# EAGLE design MySens-easyRS485-BluePill-V03-010 (EAGLE 9.1.0)
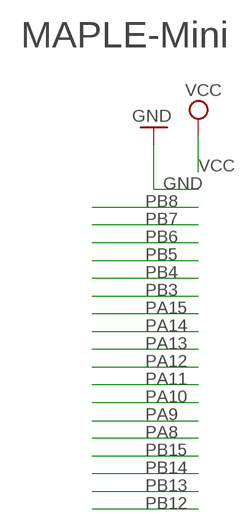
[diagram p0: schematic, sheet 1, part 1 of 2]
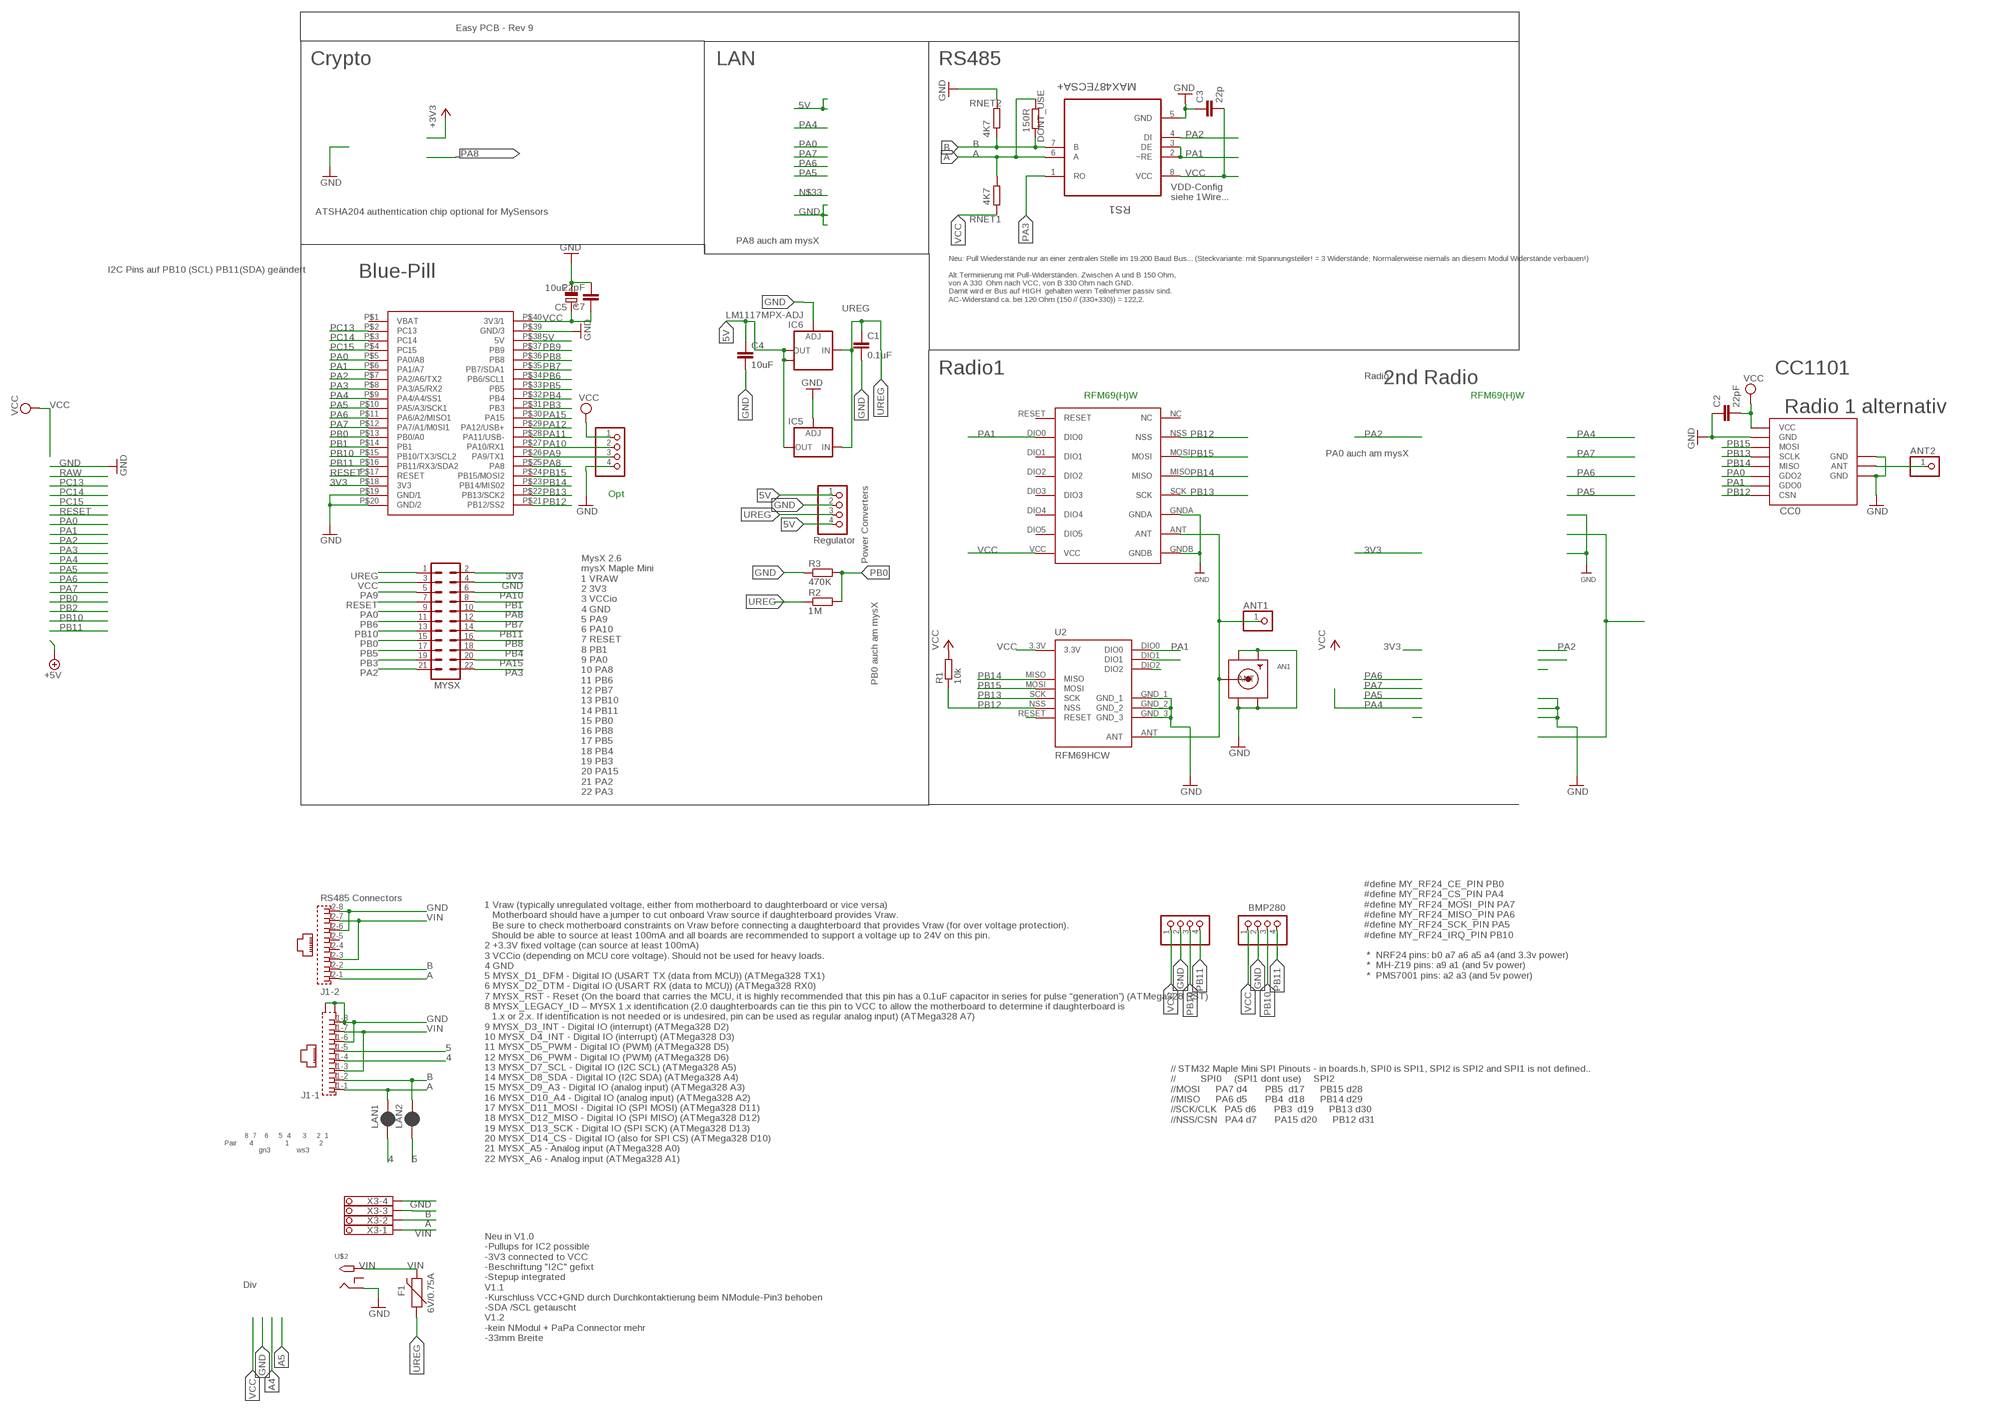
[diagram p1: schematic, sheet 1, part 2 of 2]

## Parts
AN1  SMACONNECTOR_EDGE  [SMA_EDGELAUNCH]
ANT1  PINHD-1X1  [1X01]
ANT2  PINHD-1X1  [1X01]
BH1750  PINHD-1X04_2.54-S  [1X04-S]
C1  0.1uF  C-EUC1206  [C1206]
C2  22pF  C-EUC0805  [C0805]
C3  22p  C-EUC0805  [C0805]
C4  10uF  C-EUC1210  [C1210]
C5  10uF  CPOL-EUR/2012-12W  [R/2012-12W]
C7  22pF  C-EUC0805  [C0805]
CC0  CC1101  CC1101_MODULE1SMD  [CC1101_MODULE1_SMD]
DBG  PINHD-1X04_2.54-S  [1X04-S]
DONT_USE  150R  R-EU_R0805  [R0805]
F1  6V/0.75A  PPTC_THREE-QUARTER-AMP  [1206]
I2C-1  PINHD-1X04_2.54-S  [1X04-S]
IC5  LD117ADT50TR  [DPACK]
IC6  LM1117MPX-ADJ  [SOT223]
J1  RJ45_2X_S  [RJ45_2X_S]
LAN1  JUMPER-SMT_2_NC_PASTE_SILK  [SMT-JUMPER_2_NC_PASTE_SILK]
LAN2  JUMPER-SMT_2_NC_PASTE_SILK  [SMT-JUMPER_2_NC_PASTE_SILK]
MYSX  MA11-2  [MA11-2]
R1  10k  R-EU_M0805  [M0805]
R2  1M  R-EU_R0805  [R0805]
R3  470K  R-EU_R0805  [R0805]
RFM69W1  RFM69HW  [RFM]
RNET1  4K7  R-EU_R0805  [R0805]
RNET2  4K7  R-EU_R0805  [R0805]
RS1  MAX487ECSA+  [SOIC127P600X175-8N]
STEPDWN  PINHD-1X04_2.54-S  [1X04-S]
U2  RFM69HCW  [RFM69HCW-XXXS2]
U$2  2.1MMJACKTHM  [PJ-102A]
U$4  BLUEPILL  [BLUEPILL]
X3  1751264  [1751264]

## Nets
3V3: MYSX.2 U$4.P$18(3V3) ; supply symbol labelled +3V3
4: J1.1-4 LAN1.1
5: J1.1-5 LAN2.1
5V: C4.1 IC5.4(OUT) IC6.2(OUT) IC6.TAB(OUT1) STEPDWN.1 STEPDWN.4 U$4.P$38(5V)
A: DONT_USE.1 J1.1-1 J1.2-1 LAN1.2 RNET1.2 RS1.6(A) X3.2
ANT0: ANT2.1 CC0.ANT
ANT1: AN1.P(ANT) ANT1.1 RFM69W1.ANT U2.ANT
B: DONT_USE.2 J1.1-2 J1.2-2 LAN2.2 RNET2.1 RS1.7(B) X3.3
GND [PWR]: AN1.GND@1(GND4) AN1.GND@2(GND3) AN1.GND@3(GND2) AN1.GND@4(GND1) BH1750.2 C1.2 C2.1 C3.1 C4.2 C5.- C7.2 CC0.GND@0(GND) CC0.GND@1(GND) CC0.GND@2(GND) DBG.4 I2C-1.2 IC5.1(ADJ) IC6.1(ADJ) J1.1-6 J1.1-8 J1.2-6 J1.2-8 J1.G1(-1:S2) J1.G3(-1:S1) MYSX.4 R3.1 RFM69W1.GNDA RFM69W1.GNDB RNET2.2 RS1.5(GND) STEPDWN.2 U2.GND_1 U2.GND_2 U2.GND_3 U$2.RING U$4.P$19(GND/1) U$4.P$20(GND/2) U$4.P$39(GND/3) X3.4
N$4: U2.DIO2
N$8: U2.DIO1
N$9: U2.RESET
PA0: CC0.GDO2 MYSX.9 U$4.P$5(PA0/A8)
PA1: CC0.GDO0 RFM69W1.DIO0 RS1.2(~RE) RS1.3(DE) U2.DIO0 U$4.P$6(PA1/A7)
PA2: MYSX.21 RS1.4(DI) U$4.P$7(PA2/A6/TX2)
PA3: MYSX.22 RS1.1(RO) U$4.P$8(PA3/A5/RX2)
PA4: U$4.P$9(PA4/A4/SS1)
PA5: U$4.P$10(PA5/A3/SCK1)
PA6: U$4.P$11(PA6/A2/MISO1)
PA7: U$4.P$12(PA7/A1/M0SI1)
PA8: MYSX.10 U$4.P$25(PA8)
PA9: DBG.3 MYSX.5 U$4.P$26(PA9/TX1)
PA10: DBG.2 MYSX.6 U$4.P$27(PA10/RX1)
PA11: U$4.P$28(PA11/USB-)
PA12: U$4.P$29(PA12/USB+)
PA15: MYSX.20 U$4.P$30(PA15)
PB0: MYSX.15 R2.2 R3.2 U$4.P$13(PB0/A0)
PB1: MYSX.8 U$4.P$14(PB1)
PB3: MYSX.19 U$4.P$31(PB3)
PB4: MYSX.18 U$4.P$32(PB4)
PB5: MYSX.17 U$4.P$33(PB5)
PB6: MYSX.11 U$4.P$34(PB6/SCL1)
PB7: MYSX.12 U$4.P$35(PB7/SDA1)
PB8: MYSX.16 U$4.P$36(PB8)
PB9: U$4.P$37(PB9)
PB10: BH1750.3 I2C-1.3 MYSX.13 U$4.P$15(PB10/TX3/SCL2)
PB11: BH1750.4 I2C-1.4 MYSX.14 U$4.P$16(PB11/RX3/SDA2)
PB12: CC0.CSN R1.1 RFM69W1.NSS U2.NSS U$4.P$21(PB12/SS2)
PB13: CC0.SCLK RFM69W1.SCK U2.SCK U$4.P$22(PB13/SCK2)
PB14: CC0.MISO RFM69W1.MISO U2.MISO U$4.P$23(PB14/MIS02)
PB15: CC0.MOSI RFM69W1.MOSI U2.MOSI U$4.P$24(PB15/MOSI2)
PC13: U$4.P$2(PC13)
PC14: U$4.P$3(PC14)
PC15: U$4.P$4(PC15)
RESET: MYSX.7 U$4.P$17(RESET)
UREG [PWR]: C1.1 F1.1 IC5.3(IN) IC6.3(IN) MYSX.1 R2.1 STEPDWN.3
VCC [PWR]: BH1750.1 C2.2 C3.2 C5.+ C7.1 CC0.VCC DBG.1 I2C-1.1 MYSX.3 R1.2 RFM69W1.VCC RNET1.1 RS1.8(VCC) U2.3.3V U$4.P$40(3V3/1)
VIN [PWR]: F1.2 J1.1-3 J1.1-7 J1.2-3 J1.2-7 U$2.TIP X3.1
Unconnected: J1.2-4 J1.2-5 RFM69W1.DIO1 RFM69W1.DIO2 RFM69W1.DIO3 RFM69W1.DIO4 RFM69W1.DIO5 RFM69W1.NC RFM69W1.RESET U$2.RING_SW U$4.P$1(VBAT)

## Notes on the sheet
- Easy PCB - Rev 9
- Crypto | LAN | RS485
- VDD-Config
  siehe 1Wire...
- ATSHA204 authentication chip optional for MySensors
- PA8 auch am mysX
- I2C Pins auf PB10 (SCL) PB11(SDA) geändert
- Blue-Pill
- Neu: Pull Wiederstände nur an einer zentralen Stelle im 19.200 Baud Bus... (Steckvariante: mit Spannungsteiler! = 3 Widerstände; Normalerweise niemals an diesem Modul Widerstände verbauen!)
  
  Alt:Terminierung mit Pull-Widerständen. Zwischen A und B 150 Ohm,
  von A 330  Ohm nach VCC, von B 330 Ohm nach GND. 
  Damit wird er Bus auf HIGH  gehalten wenn Teilnehmer passiv sind.
  AC-Widerstand ca. bei 120 Ohm (150 // (330+330)) = 122,2.
- Radio1 | CC1101
- Radio
- MAPLE-Mini | 2nd Radio
- RFM69(H)W | RFM69(H)W
- Radio 1 alternativ
- PA0 auch am mysX
- Power Converters
- Opt
- Regulator
- PB0 auch am mysX
- MysX 2.6
  mysX Maple Mini
  1 VRAW
  2 3V3
  3 VCCio
  4 GND
  5 PA9
  6 PA10
  7 RESET
  8 PB1
  9 PA0
  10 PA8
  11 PB6
  12 PB7
  13 PB10
  14 PB11
  15 PB0
  16 PB8
  17 PB5
  18 PB4
  19 PB3
  20 PA15
  21 PA2
  22 PA3
- RS485 Connectors
- BMP280
- #define MY_RF24_CE_PIN PB0 
  #define MY_RF24_CS_PIN PA4 
  #define MY_RF24_MOSI_PIN PA7 
  #define MY_RF24_MISO_PIN PA6 
  #define MY_RF24_SCK_PIN PA5 
  #define MY_RF24_IRQ_PIN PB10
  
   *  NRF24 pins: b0 a7 a6 a5 a4 (and 3.3v power)
   *  MH-Z19 pins: a9 a1 (and 5v power)
   *  PMS7001 pins: a2 a3 (and 5v power)
- // STM32 Maple Mini SPI Pinouts - in boards.h, SPI0 is SPI1, SPI2 is SPI2 and SPI1 is not defined..
  //          SPI0     (SPI1 dont use)     SPI2
  //MOSI      PA7 d4       PB5  d17      PB15 d28
  //MISO      PA6 d5       PB4  d18      PB14 d29
  //SCK/CLK   PA5 d6       PB3  d19      PB13 d30
  //NSS/CSN   PA4 d7       PA15 d20      PB12 d31
- 8  7    6     5  4      3     2  1
  Pair      4                1               2
                   gn3             ws3
- 1 Vraw (typically unregulated voltage, either from motherboard to daughterboard or vice versa)
     Motherboard should have a jumper to cut onboard Vraw source if daughterboard provides Vraw. 
     Be sure to check motherboard constraints on Vraw before connecting a daughterboard that provides Vraw (for over voltage protection). 
     Should be able to source at least 100mA and all boards are recommended to support a voltage up to 24V on this pin.
  2 +3.3V fixed voltage (can source at least 100mA)
  3 VCCio (depending on MCU core voltage). Should not be used for heavy loads.
  4 GND
  5 MYSX_D1_DFM - Digital IO (USART TX (data from MCU)) (ATMega328 TX1)
  6 MYSX_D2_DTM - Digital IO (USART RX (data to MCU)) (ATMega328 RX0)
  7 MYSX_RST - Reset (On the board that carries the MCU, it is highly recommended that this pin has a 0.1uF capacitor in series for pulse “generation”) (ATMega328 RST)
  8 MYSX_LEGACY_ID – MYSX 1.x identification (2.0 daughterboards can tie this pin to VCC to allow the motherboard to determine if daughterboard is 
     1.x or 2.x. If identification is not needed or is undesired, pin can be used as regular analog input) (ATMega328 A7)
  9 MYSX_D3_INT - Digital IO (interrupt) (ATMega328 D2)
  10 MYSX_D4_INT - Digital IO (interrupt) (ATMega328 D3)
  11 MYSX_D5_PWM - Digital IO (PWM) (ATMega328 D5)
  12 MYSX_D6_PWM - Digital IO (PWM) (ATMega328 D6)
  13 MYSX_D7_SCL - Digital IO (I2C SCL) (ATMega328 A5)
  14 MYSX_D8_SDA - Digital IO (I2C SDA) (ATMega328 A4)
  15 MYSX_D9_A3 - Digital IO (analog input) (ATMega328 A3)
  16 MYSX_D10_A4 - Digital IO (analog input) (ATMega328 A2)
  17 MYSX_D11_MOSI - Digital IO (SPI MOSI) (ATMega328 D11)
  18 MYSX_D12_MISO - Digital IO (SPI MISO) (ATMega328 D12)
  19 MYSX_D13_SCK - Digital IO (SPI SCK) (ATMega328 D13)
  20 MYSX_D14_CS - Digital IO (also for SPI CS) (ATMega328 D10)
  21 MYSX_A5 - Analog input (ATMega328 A0)
  22 MYSX_A6 - Analog input (ATMega328 A1)
- Div
- Neu in V1.0
  -Pullups for IC2 possible
  -3V3 connected to VCC
  -Beschriftung "I2C" gefixt
  -Stepup integrated
  V1.1
  -Kurschluss VCC+GND durch Durchkontaktierung beim NModule-Pin3 behoben
  -SDA /SCL getauscht
  V1.2
  -kein NModul + PaPa Connector mehr
  -33mm Breite

## Library data of the parts
AN1 = adafruit:SMACONNECTOR: SMA Connector 90° DIP SMA Connector, 50 Ohm (4UConnector: 07259)
ANT1 ANT2 = pinhead:PINHD-1X1: PIN HEADER
BH1750 DBG I2C-1 STEPDWN = pinhead-2:PINHD-1X04: PIN HEADER
C1-C4 C7 = rcl:C-EU: CAPACITOR, European symbol
C5 = rcl:CPOL-EU: POLARIZED CAPACITOR, European symbol
CC0 = wireless:CC1101_MODULE1: CC1101 wireless module for 433/868 MHz (sold from Aliexpress). DIL version for mounting with pin header (and SMD soldering) and SMD only variant available.
DONT_USE R1-R3 RNET1 RNET2 = rcl:R-EU_: RESISTOR, European symbol
F1 = SparkFun-Fuses:PPTC: Resettable Fuse PPTC Resettable Fuse. Really a sort of resistor with a polymeric positive temperature coefficient whose resistance increases dramatically with an increase in temperature. When heated by the power passing through the resistance rises causing the current to be limited, protecting the circuit. This is achieved by the transition of the polymer from a crystalline to an amorphous state where the conductive carbon separates breaking the conductive pathways found in the cool crystalline structure. When a PPTC cools back down it resumes conducting letting the circuit turn back on. SparkFun Products: SparkFun RedBoard - Programmed with Arduino <https://www.sparkfun.com/products/12757> Pro Micro - 5V/16MHz <https://www.sparkfun.com/products/12640> Arduino Pro 328 - 5V/16MHz <https://www.sparkfun.com/products/10915> MP3 Trigger <https://www.sparkfun.com/products/13720>; PROD_ID: RES-11150
IC5 = v-reg:LD117A?*: Low drop fixed and adjustable positive voltage regulators 1 A Source: http://www.st.com/stonline/products/literature/ds/7194/ld1117axx.pdf
IC6 = lm1117:LM1117MPX-ADJ
J1 = RJ45:RJ45_2X_S: AMP connector
LAN1 LAN2 = SparkFun-Jumpers:JUMPER-SMT_2_NC_PASTE: Normally closed solder jumper This jumper has an aperture in the stencil to allow solder paste to bridge the split in the wire so it's normally closed (NC). Wick off the solder to open the connection. Reapply solder to reclose the connection.
MYSX = con-Pinheader:MA11-2: PIN HEADER; OC_FARNELL: unknown; OC_NEWARK: unknown
RFM69W1 = hoperf:RFM69HW
RS1 = Maxim_By_element14_Batch_1:MAX487ECSA+: Low-Power, Slew-Rate-Limited RS-485/RS-422 Transceivers; MPN: MAX487ECSA+; OC_FARNELL: 9724532; OC_NEWARK: 68K4803; PACKAGE: SOIC-8; SUPPLIER: Maxim
U2 = doug:RFM69H
U$2 = adafruit:2.1MMJACK: 2.1mm x 5.5mm THM DC jack with internal switch. Digikey part #PJ-102A, 4UCON part #05537 2.1mm x 5.5mm SMT DC jack with internal switch. Digikey part #PJ-002A-SMT, 4UCON part #03267 By microbuilder.eu & adafruit.com
U$4 = stm32duino boards:BLUEPILL
X3 = con-phoenix-350:1751264: MKDS 1/ 4-3,5 Printklemme Nennstrom: 10 A Bemessungsspannung: 160 V Raster: 3,5 mm Polzahl: 4 Montageart: Löten Anschlussart: Schraubanschluss Anschlussrichtung vom Leiter zur Platine: 0° Source: http://eshop.phoenixcontact.com .. 1751264.pdf; MPN: 1751264; OC_FARNELL: unknown; OC_NEWARK: 10R0934

## Net classes
0 default: width 0.254 mm, clearance 0.205 mm
1 PWR: width 0.406 mm, clearance 0.205 mm to class 0, clearance 0.205 mm

## Board
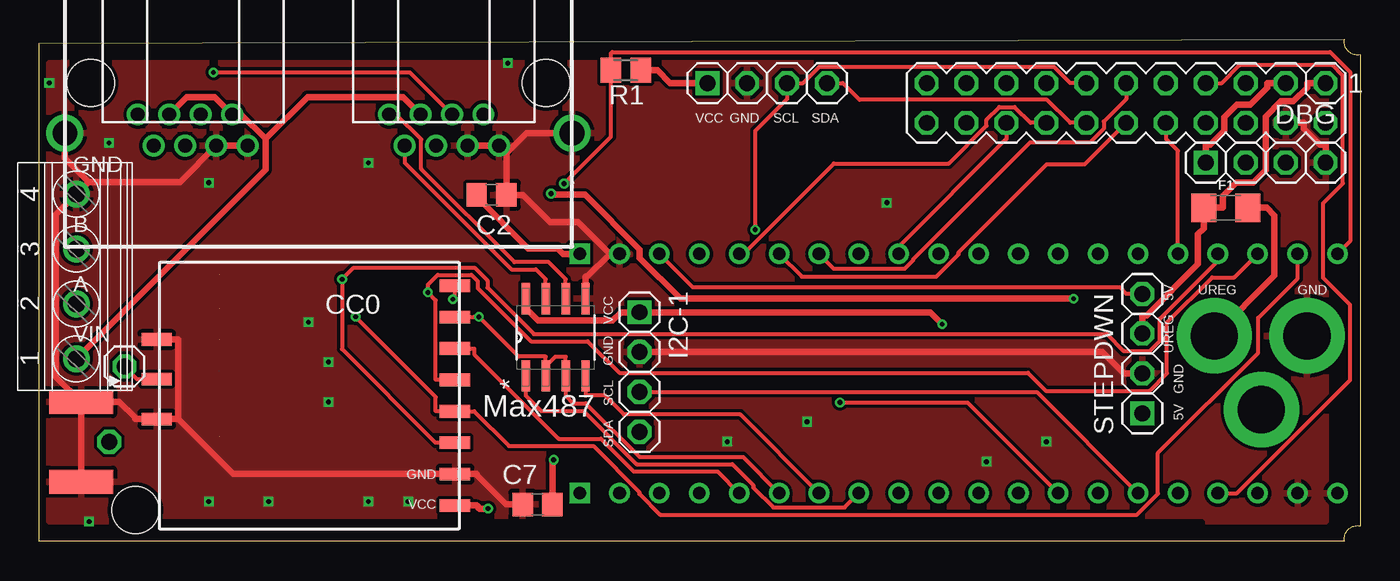
[diagram p2: board, top side]
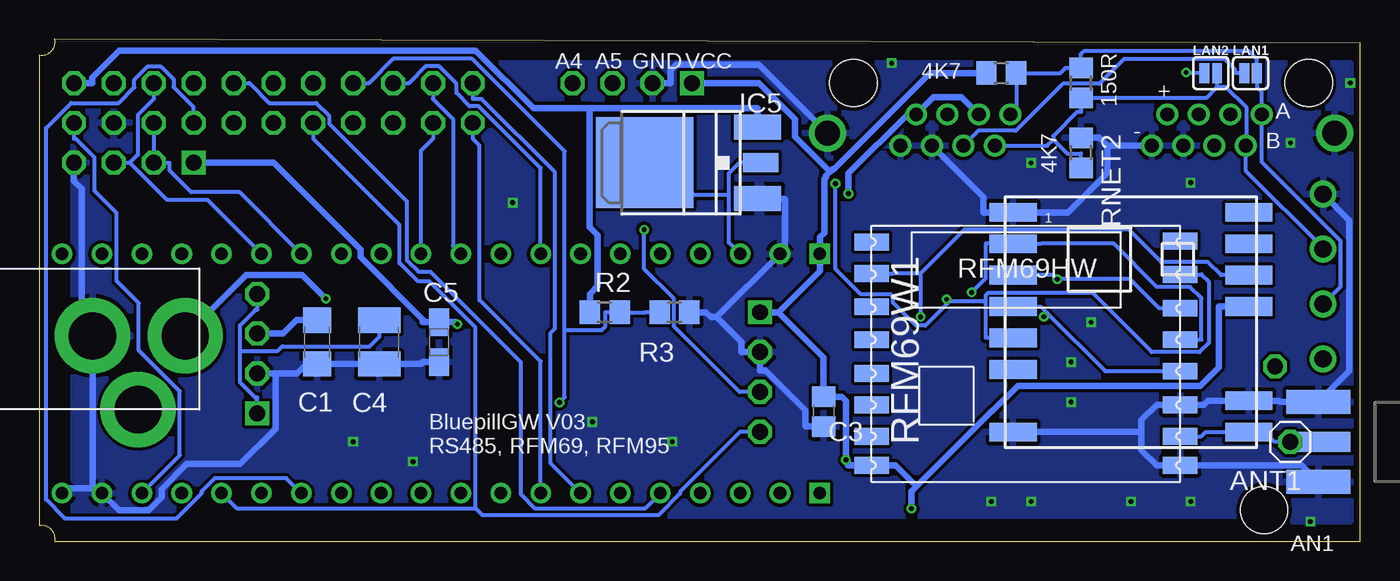
[diagram p3: board, bottom side, seen from below]

Size 84.12 x 32 mm. Coordinates in mm from the lower left corner, seen from the top.
Outline: 84.12,31 84.12,1 arc113 83.12,0 0,0 0,31.75 83.12,32 arc113 84.12,31
Copper layers (1*16): Top 0.035mm / dielectric 1.5mm / Bottom 0.035mm
Design rules "dirt_cheap_dirty_boards.v1": minimum track width 5mil, minimum drill 12mil, track to track 5mil, track to pad 5mil, pad to pad 5mil, via to via 5mil, smd to smd 0mil, copper to edge 10mil, drill to drill 10mil, minimum pad ring 10mil, minimum via ring 6mil, stop-mask expansion 2mil, vias tented up to drill 25mil, thermal gap 10mil
Holes 3 mm at 6.12,2
tRestrict: area 8,0.6 to 74.1,1.3
bRestrict: area 8,0.6 to 74.1,1.3

### Footprints (pad centres in the part's own frame; a part is rotated, then mirrored left to right if it is on the bottom)
SMA_EDGELAUNCH = smd 4.064 x 1.524: GND@1 2.032,-2.54; GND@2 2.032,2.54 | smd 4.064 x 1.524 bottom: GND@3 2.032,2.54; GND@4 2.032,-2.54 | smd 4.064 x 1.27: P 2.032,0
1X01 = drill 1.016 octagon: 1 0,0
1X04-S = drill 1.016 square: 1 -3.81,0 | drill 1.016 octagon: 2 -1.27,0; 3 1.27,0; 4 3.81,0
C1206 = smd 1.6 x 1.8: 1 -1.4,0; 2 1.4,0
C0805 = smd 1.3 x 1.5: 1 -0.95,0; 2 0.95,0
C1210 = smd 1.6 x 2.7: 1 -1.4,0; 2 1.4,0
R/2012-12W = smd 1.75 x 1.26: + 1.275,0; - -1.275,0
CC1101_MODULE1_SMD = smd 1.93 x 0.813: ANT 19,5.96; CSN 0,0; GDO0 0,2; GDO2 0,4; GND@0 0,12; GND@1 19,8.5; GND@2 19,3.42; MISO 0,6; MOSI 0,10; SCLK 0,8; VCC 0,14
R0805 = smd 1.3 x 1.5: 1 -0.95,0; 2 0.95,0
1206 = smd 1.6 x 1.8: 1 -1.4,0; 2 1.4,0
DPACK = smd 1.6 x 3: 1 -2.28,-4.8; 3 2.28,-4.8 | smd 5.8 x 6.2: 4 0,2.38
SOT223 = smd 1.219 x 2.235: 1 -2.311,-3.099; 2 0,-3.099; 3 2.311,-3.099 | smd 3.6 x 2.2: TAB 0,3.099
RJ45_2X_S = drill 0.889: 1-1 -4.5,2; 1-2 -5.5,4; 1-3 -6.5,2; 1-4 -7.5,4; 1-5 -8.5,2; 1-6 -9.5,4; 1-7 -10.5,2; 1-8 -11.5,4; 2-1 11.5,2; 2-2 10.5,4; 2-3 9.5,2; 2-4 8.5,4; 2-5 7.5,2; 2-6 6.5,4; 2-7 5.5,2; 2-8 4.5,4 | drill 1.575 pad 2.184: G1 -16.15,3.2; G3 16.15,3.2 | hole 3: -14.5,0; 14.5,0
SMT-JUMPER_2_NC_PASTE_SILK = smd 0.635 x 1.27: 1 -0.406,0; 2 0.406,0
MA11-2 = drill 1.016 octagon: 1 -12.7,-1.27; 2 -12.7,1.27; 3 -10.16,-1.27; 4 -10.16,1.27; 5 -7.62,-1.27; 6 -7.62,1.27; 7 -5.08,-1.27; 8 -5.08,1.27; 9 -2.54,-1.27; 10 -2.54,1.27; 11 0,-1.27; 12 0,1.27; 13 2.54,-1.27; 14 2.54,1.27; 15 5.08,-1.27; 16 5.08,1.27; 17 7.62,-1.27; 18 7.62,1.27; 19 10.16,-1.27; 20 10.16,1.27; 21 12.7,-1.27; 22 12.7,1.27
M0805 = smd 1.3 x 1.6: 1 -0.95,0; 2 0.95,0
RFM = smd 2.184 x 1.067: ANT 19.651,2.889; DIO0 0,13.27; DIO1 0,11.143; DIO2 0,9.047; DIO3 0,6.889; DIO4 0,4.889; DIO5 0,2.889; GNDA 19.651,4.889; GNDB 19.651,1.048; MISO 19.651,9.047; MOSI 19.651,11.047; NC 19.651,15.334; NSS 19.651,13.206; RESET 0,15.27; SCK 19.651,7.048; VCC 0,1.048
SOIC127P600X175-8N = smd 1.981 x 0.533: 1 -2.464,1.905; 2 -2.464,0.635; 3 -2.464,-0.635; 4 -2.464,-1.905; 5 2.464,-1.905; 6 2.464,-0.635; 7 2.464,0.635; 8 2.464,1.905
RFM69HCW-XXXS2 = smd 3 x 1.2: 3.3V 7.5,1; ANT 7.5,-7; DIO0 7.5,3; DIO1 7.5,5; DIO2 7.5,7; GND_1 7.5,-5; GND_2 -7.5,-7; GND_3 -7.5,7; MISO -7.5,5; MOSI -7.5,3; NSS -7.5,-1; RESET -7.5,-3; SCK -7.5,1
PJ-102A = drill 3 pad 4.8: RING 0.1,-3.39; RING_SW -4.6,-6.29; TIP 0.1,-9.29
BLUEPILL = drill 0.8 square: P$1 -7.62,22.86; P$40 7.62,22.86 | drill 0.8: P$2 -7.62,20.32; P$3 -7.62,17.78; P$4 -7.62,15.24; P$5 -7.62,12.7; P$6 -7.62,10.16; P$7 -7.62,7.62; P$8 -7.62,5.08; P$9 -7.62,2.54; P$10 -7.62,0; P$11 -7.62,-2.54; P$12 -7.62,-5.08; P$13 -7.62,-7.62; P$14 -7.62,-10.16; P$15 -7.62,-12.7; P$16 -7.62,-15.24; P$17 -7.62,-17.78; P$18 -7.62,-20.32; P$19 -7.62,-22.86; P$20 -7.62,-25.4; P$21 7.62,-25.4; P$22 7.62,-22.86; P$23 7.62,-20.32; P$24 7.62,-17.78; P$25 7.62,-15.24; P$26 7.62,-12.7; P$27 7.62,-10.16; P$28 7.62,-7.62; P$29 7.62,-5.08; P$30 7.62,-2.54; P$31 7.62,0; P$32 7.62,2.54; P$33 7.62,5.08; P$34 7.62,7.62; P$35 7.62,10.16; P$36 7.62,12.7; P$37 7.62,15.24; P$38 7.62,17.78; P$39 7.62,20.32
1751264 = drill 1.1 pad 1.7: 1 -5.25,-0.1; 2 -1.75,-0.1; 3 1.75,-0.1; 4 5.25,-0.1

### Placement (x,y rotation side)
AN1  0.64,6.35 180 bottom
ANT1  4.45,6.35 90 bottom
ANT2  5.43,11.14 0 top
BH1750  46.35,29.21 0 top
C1  66.44,12.7 270 bottom
C2  28.8,22.09 180 top
C3  34.17,8.28 90 bottom
C4  62.47,12.7 270 bottom
C5  58.66,12.7 90 bottom
C7  31.73,2.37 180 top
CC0  26.48,16.3 180 top
DBG  78.11,24.13 0 top
DONT_USE  17.78,29.21 270 bottom
F1  75.56,21.26 0 top
I2C-1  38.23,10.79 270 top
IC5  43.18,24.13 90 bottom
IC6  41.27,24.13 90 bottom
J1  17.78,29.21 180 top
LAN1  6.98,29.84 0 bottom
LAN2  9.52,29.84 0 bottom
MYSX  69.22,27.94 180 top
R1  37.35,30.04 0 top
R2  48.12,14.61 0 bottom
R3  43.67,14.61 180 bottom
RFM69W1  31.12,3.81 0 bottom
RNET1  22.86,29.84 0 bottom
RNET2  17.78,24.77 90 bottom
RS1  32.88,13.01 90 top
STEPDWN  70.25,11.97 90 top
U2  14.61,13.97 0 bottom
U$2  84.12,13 90 bottom
U$4  57.28,10.7 90 top
X3  2.27,16.88 90 top

### Tracks (layer width: path | path; a pad name or v marks a point on that pad's centre or on a via)
3V3
  Bottom 0.254: U$4.P$18 75.17,5.5 75.17,9.57 77.78,12.19 77.78,15.18 79.2,16.6 79.2,20.94 80.6,22.34 80.6,24.45 81.81,25.65 81.92,25.65 MYSX.2
4
  Bottom 0.254: LAN1.1 7.96,29.84 7.96,30.06 8.64,30.73 15.05,30.73 16.62,29.16 18.94,29.16 21.94,26.16 24.33,26.16 J1.1-4
5  (via drill 0.3 pad 0.61)
  Top 0.254: v11.1,29.89 23.6,29.89 J1.1-5
  Bottom 0.254: LAN2.1 11.05,29.84 v11.1,29.89
5V
  Top 0.254: STEPDWN.4 69.23,15.78 68.81,16.2 41.61,16.2 U$4.P$38
  Bottom 0.254: 40.21,22.08 40.21,23.46 39.55,24.13 IC6.2 | U$4.P$38 40.21,19.04 40.21,22.08 | 40.21,22.08 44.37,22.08 IC6.TAB IC5.4 | 71.34,12.14 71.34,13.78 70.35,14.76 70.25,14.76 STEPDWN.4 | 71.34,12.14 71.34,10.14 70.37,9.18 70.25,9.18 STEPDWN.1 | 71.34,12.14 68.94,12.14 68.65,12.43 63.08,12.43 62.47,13.05 C4.1
A
  Top 0.254: J1.1-1 22.74,27.21 24.33,25.62 24.33,23.73 30.27,17.79 32.44,17.79 33.52,16.71 RS1.6
  Bottom 0.254: X3.2 1.25,16.25 1.25,19.15 6.28,24.18 J1.2-1 6.28,28.66 6.58,28.96 LAN1.2 6.58,30.73 7.08,31.23 17.61,31.23 17.78,31.06 DONT_USE.1 18.78,30.16 19.1,29.84 RNET1.2 21.91,27.58 J1.1-1
ANT0
  Top 0.254: CC0.ANT 6.23,10.34 ANT2.1
ANT1  (1 unrouted)
  Bottom 0.254: RFM69W1.ANT 10.12,6.7 9.85,6.97 U2.ANT 6.08,6.97 5.46,6.35 ANT1.1 AN1.P
B
  Top 0.254: RS1.7 32.25,16.71 31.63,17.33 30.08,17.33 23.28,24.13 J1.1-2
  Bottom 0.254: 19.55,25.61 18.65,24.72 17.78,24.72 RNET2.1 | 19.55,25.61 19.55,25.84 18.03,27.36 17.78,27.36 DONT_USE.2 9.81,28.26 9.12,28.96 | J1.1-2 19.95,25.21 19.55,25.61 | X3.3 2.36,18.7 7.28,23.61 J1.2-2 7.23,25.26 7.23,27.64 8.55,28.96 9.12,28.96 | LAN2.2 9.12,28.96
GND  (via drill 0.3 pad 0.61)
  Top 0.406: AN1.GND@1 5.11,8.89 6.1,7.9 6.1,7.79 CC0.GND@1 8.16,7.79 8.85,7.79 | AN1.GND@1 AN1.GND@2 | AN1.GND@1 1.06,10.5 1.06,20.82 X3.4 3.14,22.91 | STEPDWN.2 69.08,10.7 67.71,12.06 39.4,12.06 I2C-1.2 | C7.2 29.73,2.37 27.85,4.24 27.85,4.29 CC0.GND@0 12.35,4.29 8.85,7.79 | 29.75,24.74 29.75,23.24 C2.1 30.81,22.09 32.54,20.36 34.3,20.36 36.34,18.32 | 29.75,24.74 J1.1-8 J1.1-6 | 29.75,24.74 31.02,26.01 J1.G1 | CC0.GND@2 8.85,12.88 8.85,7.79 | 3.14,22.91 1.63,24.42 J1.G3 | 3.14,22.91 8.98,22.91 J1.2-6 J1.2-8 | 36.34,18.32 34.88,16.87 34.79,16.87 RS1.5 | U$4.P$39 36.34,18.32 | DBG.4 81.92,25.3 81.56,25.3 80.55,26.31 80.55,26.67 MYSX.4
  Bottom 0.406: C5.- 59.7,11.43 59.82,11.3 C4.2 C1.2 67.09,11.3 67.69,10.7 69.08,10.7 | DBG.4 81.92,22.96 81.43,22.48 81.43,13.79 U$2.RING 80.73,3.38 | BH1750.2 43.91,29.21 43.91,30.04 43.57,30.38 38.3,30.38 J1.G1 | 16.12,25.21 16.62,25.71 RNET2.2 | J1.2-8 16.12,25.21 | 16.12,25.21 16.12,23.48 18.63,20.97 U2.GND_3 24.01,20.97 24.01,21.94 J1.1-6 | 40.99,14.29 39.4,12.7 39.4,12.06 I2C-1.2 38.23,10.89 37.87,10.89 35.33,8.36 35.33,7.33 C3.1 | 40.99,14.29 41.34,14.29 41.66,14.61 R3.1 | 40.99,14.29 U$4.P$39 36.65,18.62 36.65,21.82 IC6.1 38.35,21.82 IC5.1 | 80.73,3.38 82.38,3.38 U$4.P$20 | 80.73,3.38 80.44,3.38 U$4.P$19 79.05,1.99 77.15,1.99 76.33,2.82 76.33,3.33 74.72,4.93 71.32,4.93 69.08,7.17 69.08,10.7 | 13.92,6.97 13.92,5.82 12.96,4.86 RFM69W1.GNDB 3.71,4.86 AN1.GND@2 | 13.92,6.97 13.92,7.74 12.96,8.7 RFM69W1.GNDA 9.96,8.7 9.69,8.97 U2.GND_1 5.19,8.97 5.11,8.89 AN1.GND@1 0.7,10.86 0.7,20.46 X3.4 | 13.92,6.97 20.2,6.97 U2.GND_2 | STEPDWN.2 69.08,10.7
  other vias: 4.45,25.4 10.8,22.86 20.95,24.13 17.15,13.97 18.41,11.43 18.41,8.89 10.8,2.54 3.18,1.27 14.61,2.54 20.95,2.54 23.49,2.54 43.81,6.35 48.89,7.62 60.33,5.08 64.14,6.35 53.97,21.59 29.84,30.48 0.64,29.21
  pour Top: 0.64,1.27 81.92,1.27 81.92,30.48 0.64,30.48
  pour Bottom: 0.64,30.48 0.64,1.27 81.92,1.27 81.92,30.48
PA0
  Top 0.254: U$4.P$5 43.2,4.46 37.85,4.46 35.77,6.54 33.07,6.54 27.69,11.92 27.69,12.29 CC0.GDO2
  Bottom 0.254: U$4.P$5 45.53,2.13 52.57,2.13 53.47,3.02 53.47,11.43 59.22,17.18 59.98,17.18 60.72,17.93 60.72,21.68 65.66,26.62 65.66,27.12 66.48,27.94 69.47,27.94 70.74,29.21 MYSX.9
PA1  (via drill 0.3 pad 0.61)
  Top 0.254: U$4.P$6 44.82,5.38 38.23,5.38 34.8,8.81 34.01,8.81 33.52,9.3 RS1.3 33.52,11.79 32.87,11.79 32.25,11.16 | 32.25,11.16 32.25,11.79 30.52,11.79 v27.99,14.31 27.71,14.31 27.69,14.29 CC0.GDO0 | RS1.2 32.25,11.16
  Bottom 0.254: 27.99,17.08 29.77,17.08 RFM69W1.DIO0 | 27.99,17.08 25.2,19.87 14.75,19.87 12.68,17.8 9.69,17.8 8.86,16.97 U2.DIO0 | 27.99,17.08 v27.99,14.31
PA2
  Top 0.254: RS1.4 34.79,9.3 36.03,9.3 37.24,8.09 44.64,8.09 U$4.P$7
  Bottom 0.254: MYSX.21 56.52,28.19 55.94,28.19 51.28,23.53 51.28,13.57 51.55,13.3 51.55,4.98 U$4.P$7
PA3
  Top 0.254: U$4.P$8 51.28,2.17 46.75,2.17 45.48,3.43 45.48,3.57 44.13,4.92 38.04,4.92 34.66,8.31 31.97,8.31 30.98,9.3 RS1.1
  Bottom 0.254: MYSX.22 56.52,25.65 56.09,25.23 56.09,15.38 52.19,11.49 U$4.P$8
PA8
  Top 0.254: MYSX.10 71.75,25.65 72.52,24.89 U$4.P$25
PA9
  Bottom 0.254: MYSX.5 76.83,28.19 77.85,27.18 77.85,24.64 78.36,24.13 | DBG.3 78.36,24.13 | U$4.P$26 73.41,21.76 75.99,21.76 78.36,24.13
PA10
  Bottom 0.254: U$4.P$27 71.38,22.26 74.44,22.26 75.82,23.63 75.82,24.13 DBG.2 MYSX.6
PA15
  Bottom 0.254: MYSX.20 59.06,25.65 59.81,24.89 U$4.P$30
PB0  (via drill 0.3 pad 0.61)
  Top 0.254: v50.99,8.86 59.12,8.86 U$4.P$13
  Bottom 0.254: 50.66,13.46 50.66,24.86 56.55,30.75 61.58,30.75 63.12,29.21 MYSX.15 | v50.99,8.86 50.66,9.19 50.66,13.46 | 50.66,13.46 48.31,13.46 48.07,13.7 48.07,14.61 R2.2 45.52,14.61 R3.2
PB1
  Bottom 0.254: MYSX.8 74.3,27.69 75.56,28.96 75.56,29.44 76.4,30.28 77.21,30.28 78.06,29.42 78.06,28.94 79.07,27.94 82.09,27.94 83.68,26.35 83.68,2.68 82.46,1.45 75.39,1.45 73.78,3.06 73.78,3.19 72.94,4.03 68.39,4.03 U$4.P$14
PB3
  Bottom 0.254: U$4.P$31 57.78,18.83 57.78,26.92 59.06,28.19 MYSX.19
PB4
  Top 0.254: MYSX.18 61.59,25.65 54.73,18.79 U$4.P$32
PB5
  Bottom 0.254: U$4.P$33 52.19,23.79 56.14,27.73 56.7,27.73 57.56,28.59 57.56,29.16 58.67,30.27 59.51,30.27 60.58,29.21 MYSX.17
PB6
  Top 0.254: U$4.P$34 50.61,17.37 55.11,17.37 55.64,17.9 55.64,17.98 63.09,25.42 66.91,25.42 67.78,26.3 67.78,26.76 69.22,28.19 MYSX.11
PB7
  Top 0.254: U$4.P$35 48.56,16.87 57.12,16.87 58.55,18.3 58.55,18.41 64.16,24.03 66.57,24.03 MYSX.12
PB8
  Top 0.254: U$4.P$36 44.84,18.32 50.6,24.09 57.92,24.09 60.33,26.49 60.33,26.87 61.14,27.69 62.1,27.69 63.12,26.67 MYSX.16
PB10  (via drill 0.3 pad 0.61)
  Top 0.254: v45.6,19.87 45.6,26.17 47.62,28.19 BH1750.3 48.13,29.21 48.64,29.21 49.67,30.23 64.63,30.23 65.66,29.21 MYSX.13 | U$4.P$15 63.53,9.53 39.24,9.53 I2C-1.3
  Bottom 0.254: I2C-1.3 39.53,9.53 43.71,13.71 43.71,15.48 45.6,17.36 v45.6,19.87
PB11
  Top 0.254: BH1750.4 51.18,29.21 52.25,28.14 64.18,28.14 65.66,26.67 MYSX.14
  Bottom 0.254: MYSX.14 66.67,25.65 61.18,20.16 61.18,17.74 60.01,16.56 59.27,16.56 56.35,13.65 56.35,2.13 | U$4.P$16 71.56,2.13 56.35,2.13 | I2C-1.4 39.49,6.99 43.3,3.17 43.3,3.06 44.7,1.67 55.89,1.67 56.35,2.13
PB12  (via drill 0.3 pad 0.61)  (1 unrouted)
  Top 0.254: U$4.P$21 83.48,19.13 83.48,29.91 82.21,31.18 36.49,31.18 36.4,31.09 R1.1 36.4,25.78 v33.42,22.8 | v26.33,15.44 26.48,15.58 CC0.CSN
  Bottom 0.254: 26.27,15.3 26.27,15.19 27.7,13.75 28.28,13.75 29.77,15.24 29.77,15.59 29.92,15.74 31.79,15.74 33.42,17.37 v33.42,22.8 | v26.33,15.44 26.27,15.37 26.27,15.3 | 23.86,15.3 26.27,15.3 | 23.86,15.3 23.86,12.97 U2.NSS | 23.86,15.3 23.86,15.68 23.71,15.82 17.03,15.82 13.27,12.07 10.24,12.07 9.66,12.65 9.66,16.55 10.12,17.02 RFM69W1.NSS
PB13  (via drill 0.3 pad 0.61)  (1 unrouted)
  Top 0.254: U$4.P$22 80.14,16.77 77.62,14.25 77.62,12.02 71.25,5.65 71.25,3.04 69.91,1.71 39.54,1.71 38.23,3.02 38.23,3.15 35.29,6.08 29.91,6.08 27.69,8.29 26.7,8.29 CC0.SCLK 25.26,8.29 25.26,9.21 v20.15,14.31
  Bottom 0.254: 19.92,14.54 v20.15,14.31 | 19.92,14.54 16.24,10.86 RFM69W1.SCK | 19.92,14.54 20.35,14.97 U2.SCK
PB14  (via drill 0.3 pad 0.61)  (1 unrouted)
  Top 0.254: U$4.P$23 76.1,16.82 74.69,16.82 71.82,13.95 71.82,10.71 70.72,9.61 64.1,9.61 62.97,10.74 36.94,10.74 34.93,12.75 31.32,12.75 27.92,16.15 27.92,16.59 27.52,16.99 25.38,16.99 24.75,16.36 v24.75,15.87 25.26,15.37 25.26,10.29 CC0.MISO
  Bottom 0.254: v24.75,15.87 23.86,16.76 23.86,18.97 U2.MISO 21.23,18.97 20.35,18.97 15.7,18.97 12.96,16.23 10.84,16.23 10.12,15.51 10.12,12.86 RFM69W1.MISO
PB15  (via drill 0.3 pad 0.61)  (1 unrouted)
  Top 0.254: U$4.P$24 75.06,17.88 71.36,14.19 71.36,12.77 70.74,12.14 69.04,12.14 67.97,13.21 31.51,13.21 28.54,16.18 28.54,16.62 27.71,17.45 20.03,17.45 v19.29,16.71 19.29,12.26 25.26,6.29 CC0.MOSI
  Bottom 0.254: U2.MOSI 19.55,16.97 v19.29,16.71 14.66,16.71 12.81,14.86 RFM69W1.MOSI
RESET
  Top 0.254: MYSX.7 75.31,29.21 76.44,30.34 82.37,30.34 83.02,29.68 83.02,22.81 81.76,21.55 81.76,16.8 83.48,15.08 83.48,10.29 76.27,3.08 U$4.P$17
UREG
  Top 0.406: STEPDWN.3 70.25,14.41 70.53,14.41 73.78,17.66 73.78,19.57 74.17,19.95 F1.1 75.37,21.26 75.37,22.02 76.23,22.88 77.32,22.88 78.11,23.66 78.11,27.08 79.07,28.04 79.87,28.04 80.75,28.92 80.75,29.21 MYSX.1
  Bottom 0.406: C1.1 67.74,14.1 68.6,13.24 STEPDWN.3 | 49.07,27.62 52.66,27.62 56.33,31.28 79.03,31.28 80.75,29.57 80.75,29.21 MYSX.1 | 49.07,27.62 49.07,20.03 48.57,19.53 48.57,16.26 49.06,15.76 R2.1 | 49.07,27.62 38.38,27.62 IC5.3 38.35,26.44 IC6.3
VCC  (via drill 0.3 pad 0.61)
  Top 0.406: DBG.1 74.3,25.3 74.59,25.3 75.47,26.18 75.47,27.03 76.28,27.84 77.13,27.84 78.2,28.92 78.2,29.21 MYSX.3 | v57.5,13.85 56.74,14.61 I2C-1.1 37.64,14.61 37.05,14.61 36.52,14.07 31.78,14.07 30.98,14.87 RS1.8 | C7.1 32.69,5.13 v32.76,5.2 | U$4.P$40 33.35,18.32 33,18.68 31.14,18.68 27.85,21.97 C2.2 | BH1750.1 40.18,29.21 39.36,30.04 R1.2 | CC0.VCC 27.85,2.29 28.05,2.1 v28.58,2.1
  Bottom 0.406: DBG.1 69.2,24.13 63.67,18.6 63.67,18.12 59.7,14.15 59.7,13.97 C5.+ 57.62,13.97 v57.5,13.85 | 33.77,23.56 34.01,23.32 34.01,23.22 34.13,23.1 34.13,19.67 34.41,19.38 U$4.P$40 34.41,17.25 37.05,14.61 | 33.77,23.56 33.59,23.74 33.52,23.74 27.41,29.84 RNET1.1 | 33.77,23.56 36.01,25.8 36.01,26.92 38.3,29.21 41.38,29.21 BH1750.1 | 28.27,3.51 23.46,8.31 23.42,8.31 21.82,9.92 10.19,9.92 9.01,11.09 9.01,14.97 U2.3.3V | I2C-1.1 37.05,14.61 | 37.05,14.61 34.17,11.72 C3.2 33.02,9.22 32.76,8.96 v32.76,5.2 32.62,5.06 32.62,4.86 RFM69W1.VCC 29.61,4.86 28.27,3.51 | 28.27,3.51 28.58,3.19 v28.58,2.1
VIN  (via drill 0.3 pad 0.61)
  Top 0.406: F1.2 78.17,21.26 78.67,20.77 78.67,16.93 U$2.TIP | v32.59,22.17 32.67,22.09 34.75,22.09 38.23,18.61 38.23,18.07 40.83,15.47 v65.88,15.47 | 14.41,25.65 12.86,27.21 J1.2-7 11.17,28.32 9.39,28.32 J1.2-3 | X3.1 14.41,23.68 14.41,25.65 | J1.1-3 23.17,28.32 17.08,28.32 14.41,25.65
  Bottom 0.406: v32.59,22.17 32.59,23.46 28.85,27.21 J1.1-7 27.17,28.32 25.39,28.32 J1.1-3 | v65.88,15.47 67.39,16.98 70.96,16.98 U$2.TIP

### Text on the board
tNames: VCC | GND | SCL | SDA | GND | B | A | VCC | 5V | UREG | GND | UREG | VIN | GND | GND | SCL | Max487 | 5V | SDA | GND | VCC
bNames: 150R | VCC | GND | A5 | A4 | 4K7 | + | A | - | B | 4K7 | BluepillGW V03 / RS485, RFM69, RFM95